# EAGLE design V3 (EAGLE 7.6.0)
Tek 7904A LED graticule illumination mod
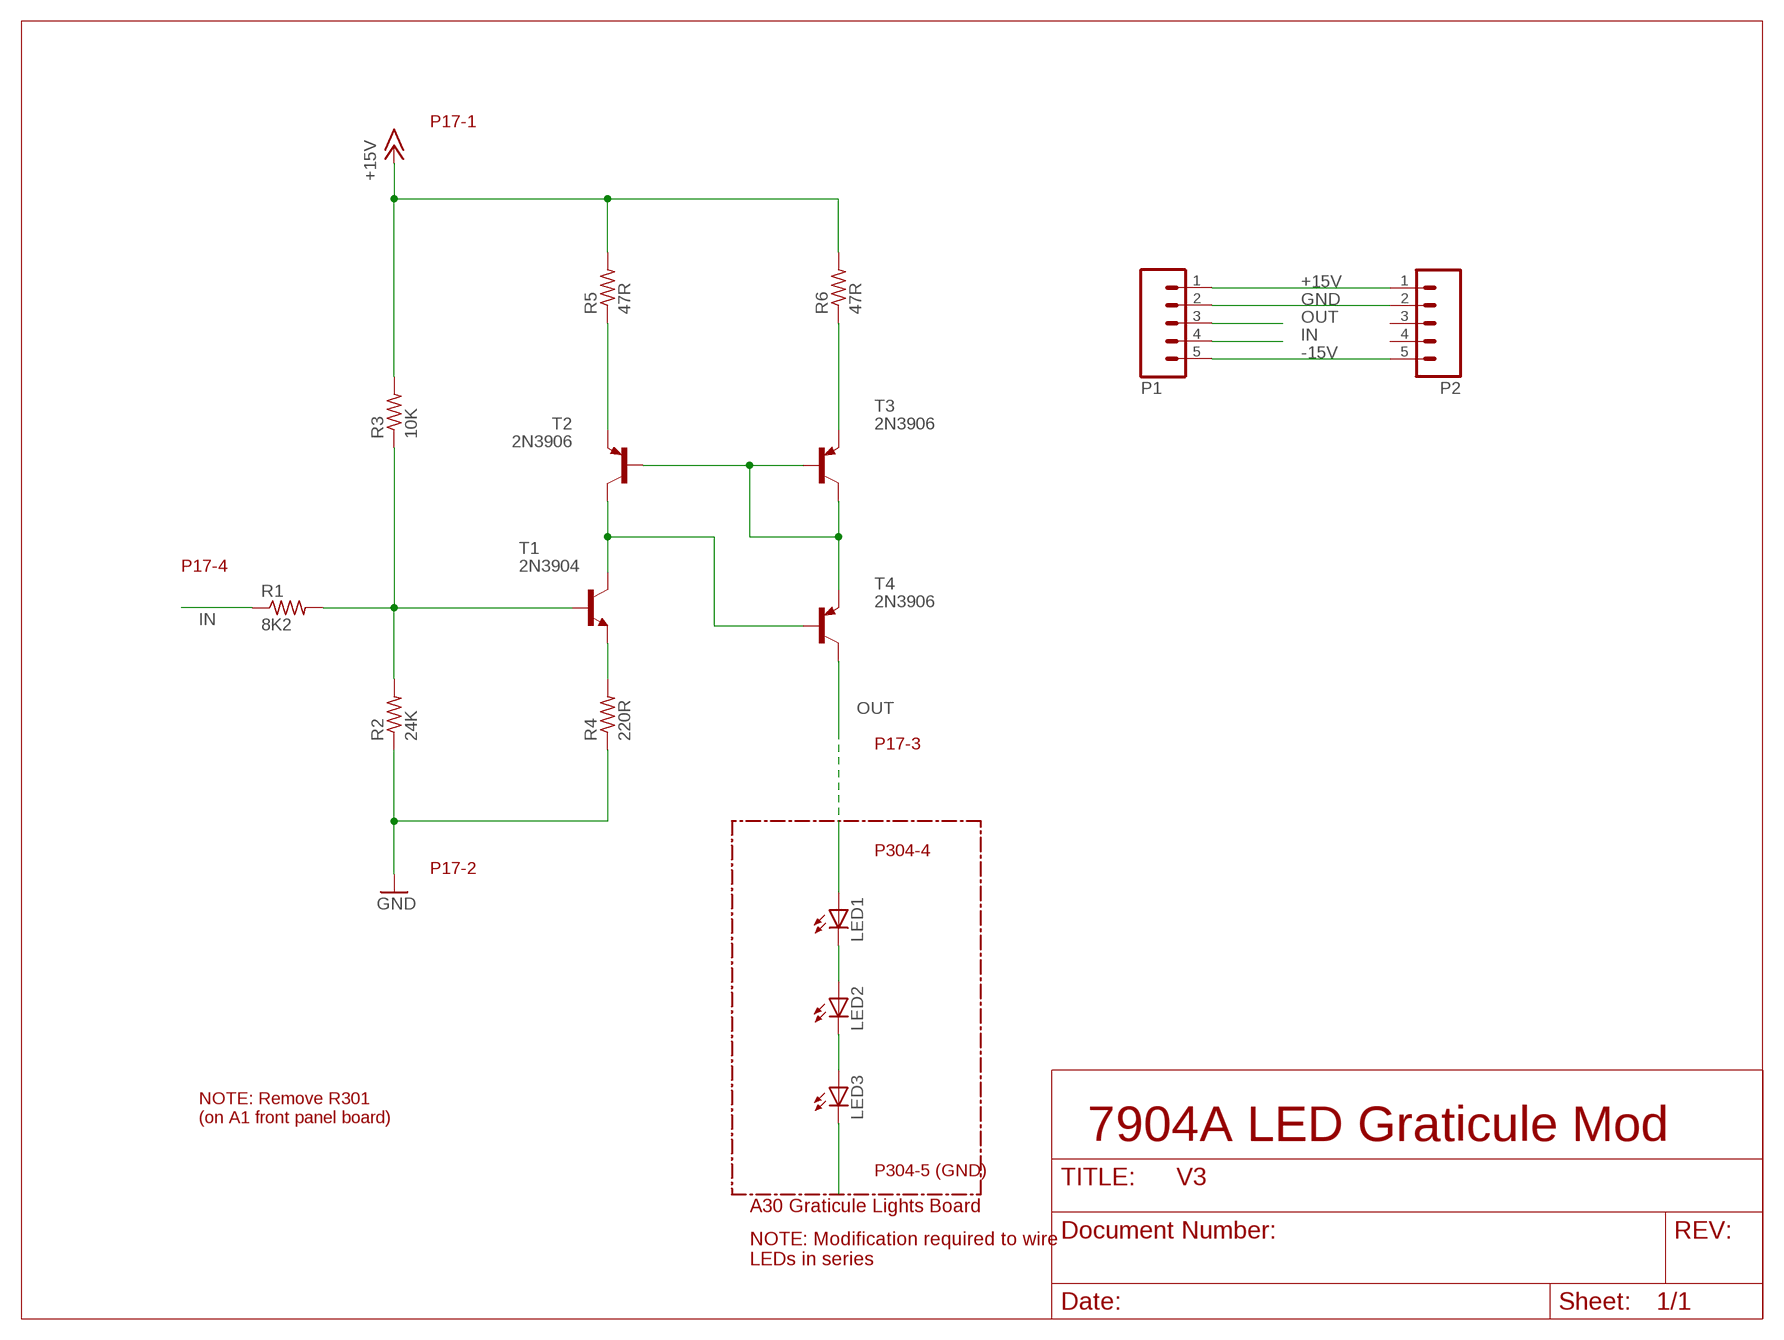
[diagram p0: schematic, sheet 1]

## Parts
LED1  LED5MM  [LED5MM]
LED2  LED5MM  [LED5MM]
LED3  LED5MM  [LED5MM]
P1  M05PTH  [1X05]
P2  M05PTH  [1X05]
R1  8K2  R-US_0309/12  [0309/12]
R2  24K  R-US_0309/V  [0309V]
R3  10K  R-US_0309/V  [0309V]
R4  220R  R-US_0309/V  [0309V]
R5  47R  R-US_0309/V  [0309V]
R6  47R  R-US_0309/V  [0309V]
T1  2N3904  -NPN-TO92-EBC  [TO92-EBC]
T2  2N3906  BC328-PNP-TO92-EBC  [TO92-EBC]
T3  2N3906  BC328-PNP-TO92-EBC  [TO92-EBC]
T4  2N3906  BC328-PNP-TO92-EBC  [TO92-EBC]

## Nets
+15V: P1.1 P2.1 R3.2 R5.2 R6.2
-15V: P1.5 P2.5
GND: P1.2 P2.2 R2.1 R4.1
IN: P1.4 R1.1
N$1: R1.2 R2.2 R3.1 T1.B
N$2: LED3.K(C)
N$3: R4.2 T1.E
N$5: R5.1 T2.E
N$7: LED2.K(C) LED3.A
N$8: LED1.K(C) LED2.A
N$9: LED1.A
N$10: R6.1 T3.E
N$11: T2.B T3.B T3.C T4.E
N$13: T1.C T2.C T4.B
OUT: P1.3 T4.C
Unconnected: P2.3 P2.4

## Notes on the sheet
- P17-1
- P17-4
- P17-3
- P304-4
- P17-2
- NOTE: Remove R301
  (on A1 front panel board)
- 7904A LED Graticule Mod
- P304-5 (GND)
- A30 Graticule Lights Board
- NOTE: Modification required to wire
  LEDs in series

## Library data of the parts
LED1-LED3 = led:LED: LED OSRAM: - CHIPLED LG R971, LG N971, LY N971, LG Q971, LY Q971, LO R971, LY R971 LH N974, LH R974 LS Q976, LO Q976, LY Q976 LO Q996 - Hyper CHIPLED LW Q18S LB Q993, LB Q99A, LB R99A - SideLED LS A670, LO A670, LY A670, LG A670, LP A670 LB A673, LV A673, LT A673, LW A673 LH A674 LY A675 LS A676, LA A676, LO A676, LY A676, LW A676 LS A679, LY A679, LG A679 - Hyper Micro SIDELED® LS Y876, LA Y876, LO Y876, LY Y876 LT Y87S - SmartLED LW L88C, LW L88S LB L89C, LB L89S, LG L890 LS L89K, LO L89K, LY L89K LS L896, LA L896, LO L896, LY L896 - TOPLED LS T670, LO T670, LY T670, LG T670, LP T670 LSG T670, LSP T670, LSY T670, LOP T670, LYG T670 LG T671, LOG T671, LSG T671 LB T673, LV T673, LT T673, LW T673 LH T674 LS T676, LA T676, LO T676, LY T676, LB T676, LH T676, LSB T676, LW T676 LB T67C, LV T67C, LT T67C, LS T67K, LO T67K, LY T67K, LW E67C LS E67B, LA E67B, LO E67B, LY E67B, LB E67C, LV E67C, LT E67C LW T67C LS T679, LY T679, LG T679 LS T770, LO T770, LY T770, LG T770, LP T770 LB T773, LV T773, LT T773, LW T773 LH T774 LS E675, LA E675, LY E675, LS T675 LS T776, LA T776, LO T776, LY T776, LB T776 LHGB T686 LT T68C, LB T68C - Hyper Mini TOPLED® LB M676 - Mini TOPLED Santana® LG M470 LS M47K, LO M47K, LY M47K Source: http://www.osram.convergy.de LUXEON: - LUMILED® LXK2-PW12-R00, LXK2-PW12-S00, LXK2-PW14-U00, LXK2-PW14-V00 LXK2-PM12-R00, LXK2-PM12-S00, LXK2-PM14-U00 LXK2-PE12-Q00, LXK2-PE12-R00, LXK2-PE12-S00, LXK2-PE14-T00, LXK2-PE14-U00 LXK2-PB12-K00, LXK2-PB12-L00, LXK2-PB12-M00, LXK2-PB14-N00, LXK2-PB14-P00, LXK2-PB14-Q00 LXK2-PR12-L00, LXK2-PR12-M00, LXK2-PR14-Q00, LXK2-PR14-R00 LXK2-PD12-Q00, LXK2-PD12-R00, LXK2-PD12-S00 LXK2-PH12-R00, LXK2-PH12-S00 LXK2-PL12-P00, LXK2-PL12-Q00, LXK2-PL12-R00 Source: www.luxeon.com KINGBRIGHT: KA-3528ASYC Source: www.kingbright.com
P1 P2 = SparkFun-Connectors:M05: Header 5 Standard 5-pin 0.1" header. Use with straight break away headers (SKU : PRT-00116), right angle break away headers (PRT-00553), swiss pins (PRT-00743), machine pins (PRT-00117), and female headers (PRT-00115). Molex polarized connector foot print use with SKU : PRT-08230 with associated crimp pins and housings.
R1-R6 = rcl:R-US_: RESISTOR, American symbol
T1 = transistor:*-NPN-: NPN Transistror BF959 corrected 2008.03.06
T2-T4 = transistor:*-PNP-: PNP Transistror

## Board
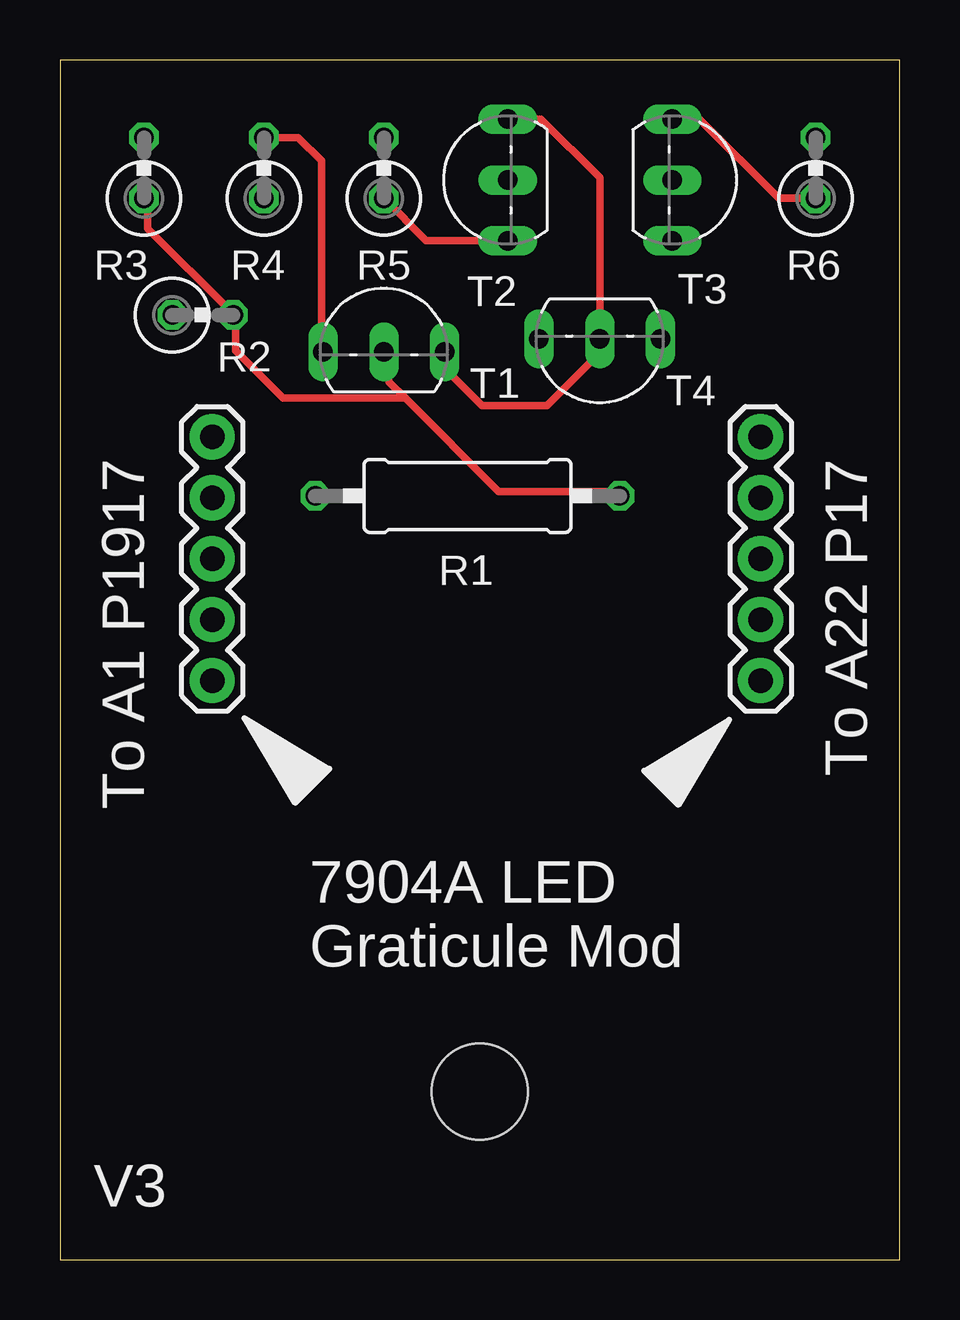
[diagram p1: board, top side]
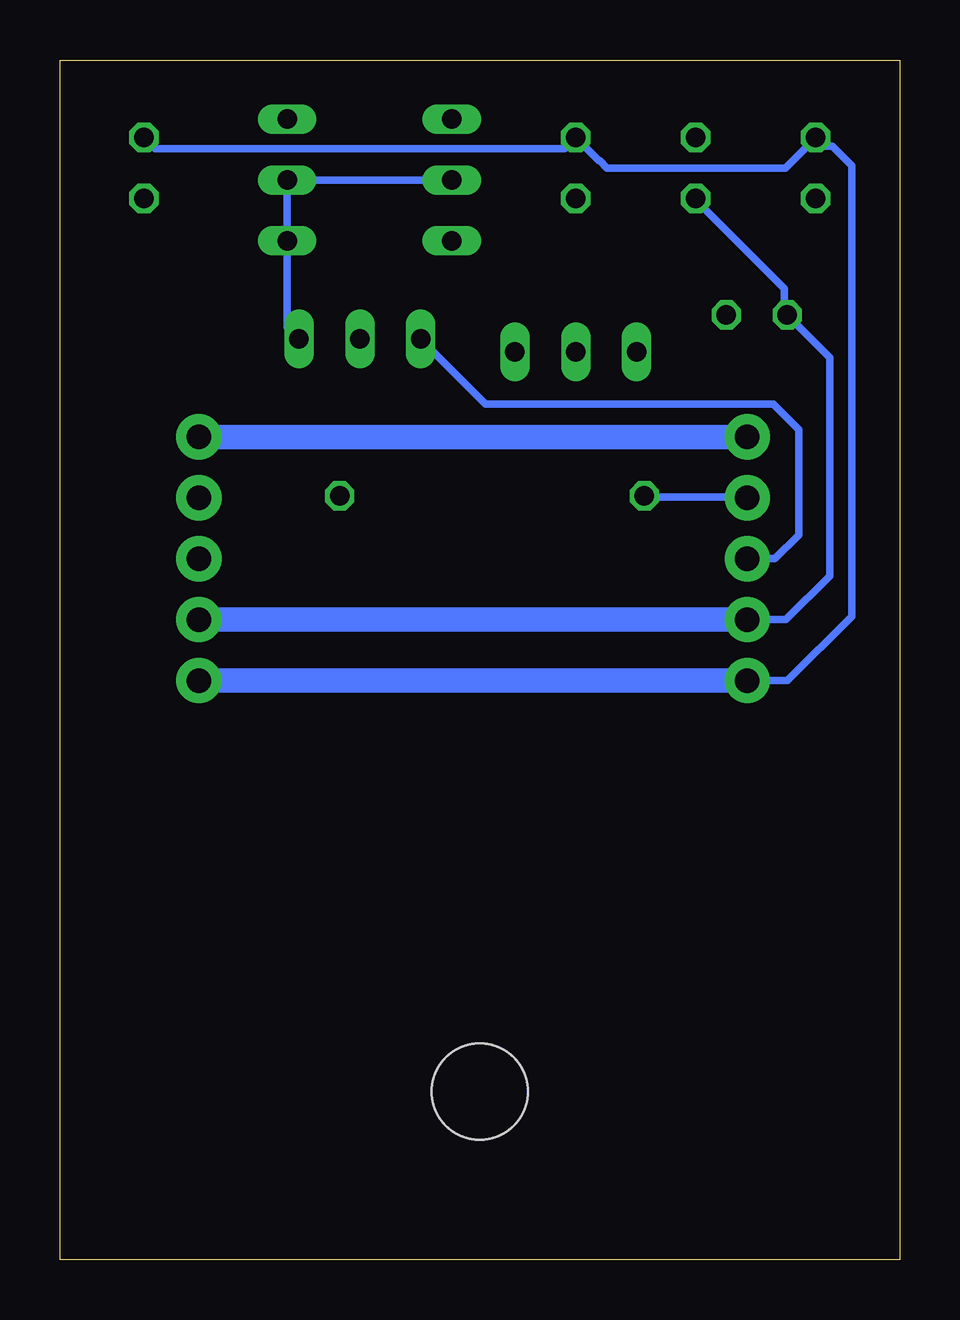
[diagram p2: board, bottom side, seen from below]

Size 35 x 50 mm. Coordinates in mm from the lower left corner, seen from the top.
Outline: 0,0 35,0 35,50 0,50 0,0
Copper layers (1*16): Top 0.035559375mm / dielectric 1.6mm / Bottom 0.035559375mm
Design rules "oshpark-2layer *": minimum track width 12mil, minimum drill 10mil, track to track 6mil, track to pad 6mil, pad to pad 6mil, via to via 6mil, smd to smd 6mil, copper to edge 15mil, drill to drill 6mil, minimum pad ring 5mil, minimum via ring 5mil, stop-mask expansion 2.5mil, vias tented up to drill 0mil, thermal gap 10mil
Holes 4 mm at 17.5,7
tKeepout: area 0,0 to 35,22
bKeepout: area 0,0 to 35,22

### Footprints (pad centres in the part's own frame; a part is rotated, then mirrored left to right if it is on the bottom)
LED5MM = drill 0.813 octagon: A -1.27,0; K 1.27,0
1X05 = drill 1.016 pad 1.88: 1 0,0; 2 2.54,0; 3 5.08,0; 4 7.62,0; 5 10.16,0
0309/12 = drill 0.813 octagon: 1 -6.35,0; 2 6.35,0
0309V = drill 0.813 octagon: 1 -1.27,0; 2 1.27,0
TO92-EBC = drill 0.813 long: B 0,-1.27; C 2.54,-1.27; E -2.54,-1.27

### Placement (x,y rotation side)
LED1  -13.5,0.1 0 top  (outside the outline)
LED2  -13.6,8 0 top  (outside the outline)
LED3  -13.4,16.1 0 top  (outside the outline)
P1  6.35,24.13 90 top
P2  29.21,24.13 90 top
R1  16.99,31.83 0 top
R2  5.95,39.37 0 top
R3  3.5,45.5 90 top
R4  8.5,45.5 90 top
R5  13.5,45.5 90 top
R6  31.5,45.5 90 top
T1  13.5,39.1 0 top
T2  17.4,45 90 top
T3  26.8,45 270 top
T4  22.5,37.1 180 top

### Tracks (layer width: path | path; a pad name or v marks a point on that pad's centre or on a via)
+15V
  Bottom 0.305: P1.1 4.67,24.13 2,26.8 2,45.6 2.8,46.4 3.13,46.4 R3.2 4.77,45.5 12.2,45.5 12.5,45.8 12.53,45.8 R5.2 13.97,46.3 31.03,46.3 R6.2
  Bottom 1.016: P1.1 P2.1
-15V
  Bottom 1.016: P1.5 P2.5
GND
  Bottom 0.305: R4.1 8.46,44.12 4.8,40.46 4.8,39.55 R2.1 2.9,37.59 2.9,28.5 4.73,26.67 P1.2
  Bottom 1.016: P1.2 P2.2
IN
  Bottom 0.305: R1.1 10.52,31.77 6.4,31.77 P1.4
N$1
  Top 0.305: R3.1 3.66,44.12 3.66,42.98 7.09,39.55 R2.2 7.32,39.32 7.32,37.88 9.3,35.9 14.4,35.9 | 14.4,35.9 13.72,36.58 T1.B | 14.4,35.9 18.29,32 23.32,32 R1.2
N$3
  Top 0.305: R4.2 9.93,46.77 10.9,45.8 10.9,37.89 T1.E
N$5
  Top 0.305: R5.1 15.27,42.46 T2.E
N$7  (1 unrouted)
N$8  (1 unrouted)
N$10
  Top 0.305: T3.E 26.66,47.54 29.97,44.23 R6.1
N$11
  Bottom 0.305: T2.B T3.B T3.C 25.53,38.86 T4.E
N$13
  Top 0.305: T1.C 16.04,37.16 17.6,35.6 20.3,35.6 22.5,37.8 T4.B 22.5,45.1 20.06,47.54 T2.C
OUT
  Bottom 0.305: P1.3 5.19,29.21 4.2,30.2 4.2,34.6 5.26,35.66 17.25,35.66 T4.C

### Text on the board
tNames: To A22 P17 | To A1 P1917 | 7904A LED / Graticule Mod | V3
tValues: V3